# EAGLE design controller_connect_board (EAGLE 7.2.0)
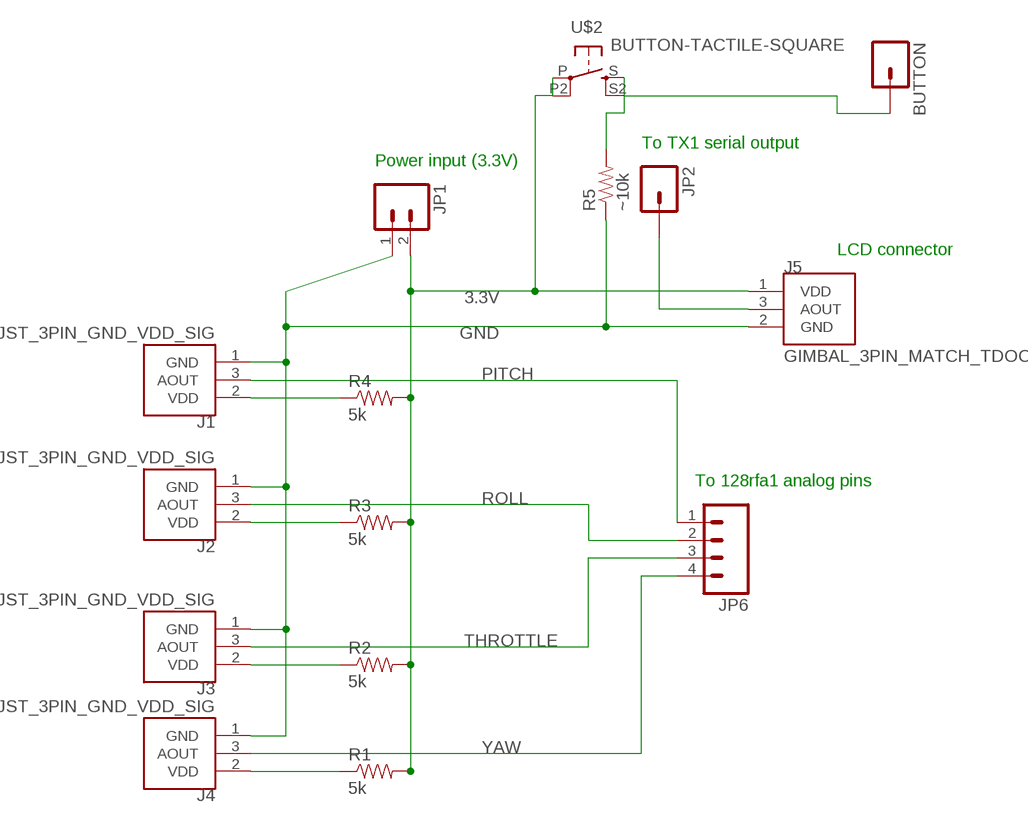
[diagram p0: schematic, sheet 1]

## Parts
BUTTON  M01PTH  [1X01]
J1  JST_3PIN_GND_VDD_SIG  [JST-3-PTH-REVERSE]
J2  JST_3PIN_GND_VDD_SIG  [JST-3-PTH-REVERSE]
J3  JST_3PIN_GND_VDD_SIG  [JST-3-PTH-REVERSE]
J4  JST_3PIN_GND_VDD_SIG  [JST-3-PTH-REVERSE]
J5  GIMBAL_3PIN_MATCH_TDOCU  [JST-3-PTH]
JP1  M021X02_NO_SILK  [1X02_NO_SILK]
JP2  M01PTH  [1X01]
JP6  M04PTH  [1X04]
R1  5k  RESISTORPTH-1/4W  [AXIAL-0.4]
R2  5k  RESISTORPTH-1/4W  [AXIAL-0.4]
R3  5k  RESISTORPTH-1/4W  [AXIAL-0.4]
R4  5k  RESISTORPTH-1/4W  [AXIAL-0.4]
R5  ~10k  RESISTORPTH-1/4W  [AXIAL-0.4]
U$2  BUTTON-TACTILE-SQUARE  [BUTTON-TACTILE-SQUARE-ADAFRUIT1010]

## Nets
3.3V: J5.1(VDD) JP1.2 R1.P$2 R2.P$2 R3.P$2 R4.P$2 U$2.P U$2.P2(P1)
GND: J1.1(GND) J2.1(GND) J3.1(GND) J4.1(GND) J5.2(GND) JP1.1 R5.P$1
N$1: J4.2(VDD) R1.P$1
N$2: J3.2(VDD) R2.P$1
N$3: J2.2(VDD) R3.P$1
N$4: J1.2(VDD) R4.P$1
N$6: BUTTON.1 R5.P$2 U$2.S U$2.S2(S1)
N$9: J5.3(AOUT) JP2.1
PITCH: J1.3(AOUT) JP6.1
ROLL: J2.3(AOUT) JP6.2
THROTTLE: J3.3(AOUT) JP6.3
YAW: J4.3(AOUT) JP6.4

## Notes on the sheet
- To TX1 serial output
- Power input (3.3V)
- LCD connector
- To 128rfa1 analog pins

## Library data of the parts
BUTTON JP2 = SparkFun-Connectors:M01: Header 1 Standard 1-pin 0.1" header. Use with straight break away headers (SKU : PRT-00116), right angle break away headers (PRT-00553), swiss pins (PRT-00743), machine pins (PRT-00117), and female headers (PRT-00115).
J1-J4 = Controller:JST_3PIN_GND_VDD_SIG
J5 = Controller:GIMBAL_3PIN_MATCH_TDOCU
JP1 = SparkFun-Connectors:M02: Standard 2-pin 0.1" header. Use with - straight break away headers ( PRT-00116) - right angle break away headers (PRT-00553) - swiss pins (PRT-00743) - machine pins (PRT-00117) - female headers (PRT-00115) Molex polarized connector foot print use with: PRT-08233 with associated crimp pins and housings. 2.54_SCREWTERM for use with PRT-10571. 3.5mm Screw Terminal footprints for PRT-08084 5mm Screw Terminal footprints for use with PRT-08432
JP6 = SparkFun-Connectors:M04: Header 4 Standard 4-pin 0.1" header. Use with straight break away headers (SKU : PRT-00116), right angle break away headers (PRT-00553), swiss pins (PRT-00743), machine pins (PRT-00117), and female headers (PRT-00115). Molex polarized connector foot print use with SKU : PRT-08231 with associated crimp pins and housings. 1MM SMD Version SKU: PRT-10208
R1-R5 = SparkFun-Resistors:RESISTOR: Resistor Basic schematic elements and footprints for 0603, 1206, and PTH resistors.
U$2 = Controller:BUTTON-TACTILE

## Board
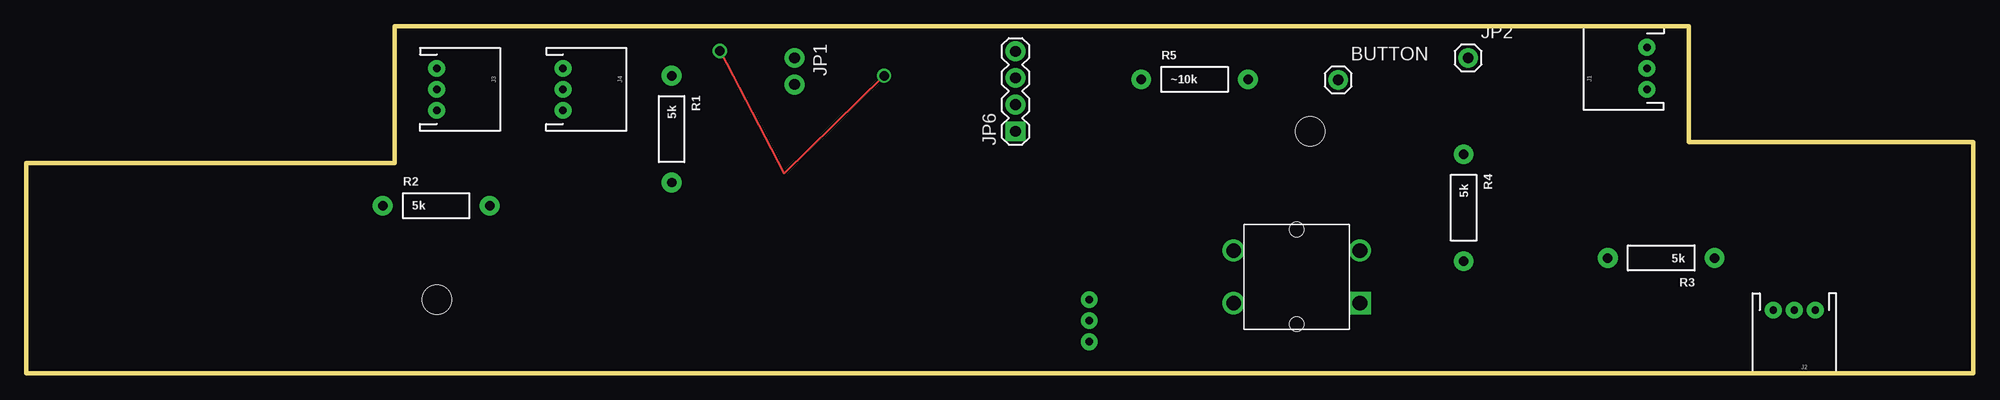
[diagram p1: board, top side]
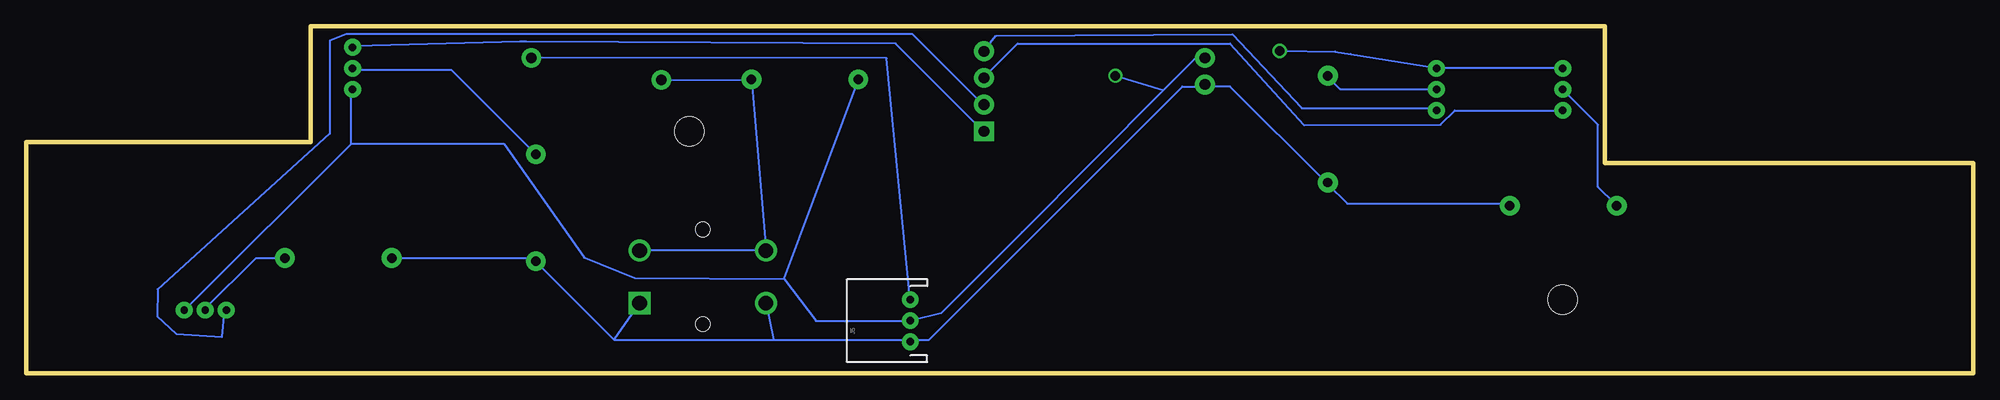
[diagram p2: board, bottom side, seen from below]

Size 185 x 33 mm. Coordinates in mm from the lower left corner, seen from the top.
Outline: 0,0 185,0 185,22 158,22 158,33 35,33 35,20 0,20 0,0
Copper layers (1*16): Top 0.035559375mm / dielectric 1.501140625mm / Bottom 0.035559375mm
Design rules "4pcb-33board *": minimum track width 0.2mm, minimum drill 0.9mm, track to track 10mil, track to pad 12mil, pad to pad 0.39mm, via to via 0.8mm, smd to smd 6mil, copper to edge 10mil, drill to drill 10mil, minimum pad ring 10mil, minimum via ring 8mil, stop-mask expansion 4mil, vias tented up to drill 0mil, thermal gap 10mil
tRestrict: area 38,23 to 40.2,30.1; area 32.6,14.9 to 35.1,17; area 42.7,14.7 to 45.6,17.4; area 49.6,23.8 to 52.3,30.3; area 71.4,26 to 74.4,31.3; area 92.3,21 to 95.8,32.5; area 99.7,1.6 to 102.3,8.6; area 135.2,9.3 to 137.9,12.1; area 135,19.4 to 138,22.1; area 135.2,28.3 to 139,31.6; area 152.7,25.7 to 155.2,32.4; area 149.1,9.7 to 151.5,12.2; 4 more areas

### Footprints (pad centres in the part's own frame; a part is rotated, then mirrored left to right if it is on the bottom)
1X01 = drill 1.016 pad 1.88: 1 0,0
JST-3-PTH-REVERSE = drill 0.7 pad 1.6: 1 -2,0; 2 0,0; 3 2,0
JST-3-PTH = drill 0.7 pad 1.6: 1 -2,0; 2 0,0; 3 2,0
1X02_NO_SILK = drill 1.016 pad 1.88: 1 0,0; 2 2.54,0
1X04 = drill 1.016 pad 1.88 square: 1 0,0 | drill 1.016 pad 1.88: 2 2.54,0; 3 5.08,0; 4 7.62,0
AXIAL-0.4 = drill 0.9 pad 1.88: P$1 -5.08,0; P$2 5.08,0
CONNECTOR_BOARD_OUTLINE = hole 2.8: 71,29; 154,45
BUTTON-TACTILE-SQUARE-ADAFRUIT1010 = drill 1.4 square: P -6,2.5 | drill 1.4: P2 6,2.5; S -6,-2.5; S2 6,-2.5 | hole 1.4: 0,4.5; 0,-4.5

### Placement (x,y rotation side)
BUTTON  124.66,27.9 0 top
J1  154,29 90 top
J2  168,6 180 top
J3  39,27 270 top
J4  51,27 270 top
J5  101,5 90 bottom
JP1  73,30 270 top
JP2  137,30 0 top
JP6  94,23 90 top
R1  61.32,23.22 270 top
R2  38.95,15.94 0 top
R3  155.35,10.96 180 top
R4  136.58,15.74 270 top
R5  111.01,27.94 0 top
U$1  [CONNECTOR_BOARD_OUTLINE]  -32,-22 0 top
U$2  120.72,9.17 180 top

### Tracks (layer width: path | path; a pad name or v marks a point on that pad's centre or on a via)
3.3V
  Bottom 0.2: R2.P$2 44.05,16.14 59.48,16.14 61.3,17.95 R1.P$2 61.52,18.18 70.6,27.26 72.87,27.26 JP1.2 73.1,27.26 75.14,27.26 99.21,3.2 100.79,3.2 J5.1 101.02,3.2 114,3.2 | 129.17,3.2 114,3.2 | 129.17,3.2 136.43,10.46 R4.P$2 136.66,10.69 136.89,10.91 150.05,10.91 R3.P$2 | U$2.P2 114,3.2 | 129.17,3.2 U$2.P
GND  (via drill 0.9)
  Top 0.2: v65.91,30.66 72,19 v81.52,28.3
  Bottom 0.2: 154.14,21.81 154.14,26.8 J1.1 | 154.14,21.81 169.8,6.15 J2.1 | J3.1 39.05,29.08 50.86,29.08 J4.1 51.08,29.08 59.15,30.36 60.65,30.6 v65.91,30.66 | 76.93,26.93 73.97,29.9 JP1.1 | 76.93,26.93 90.41,13.41 98.07,5.71 100.79,5.01 J5.2 | 154.14,21.81 139.61,21.81 132,11 127.18,9.05 112.98,8.96 | 101.02,5.01 J5.2 | 112.98,8.96 109.98,4.96 J5.2 | 112.98,8.96 R5.P$1 | v81.52,28.3 76.93,26.93
N$1
  Bottom 0.2: J4.2 51.08,27.03 60.16,27.03 61.3,28.17 R1.P$1
N$2
  Bottom 0.2: J3.2 38.82,26.8 35.65,23.63 35.65,17.73 34.06,16.14 R2.P$1
N$3
  Bottom 0.2: J2.2 167.99,6.15 163.22,10.91 160.5,10.91 R3.P$1
N$4
  Bottom 0.2: J1.2 153.91,28.85 144.61,28.85 136.66,20.9 R4.P$1
N$6
  Bottom 0.2: BUTTON.1 R5.P$2 U$2.S2 U$2.S
N$9
  Bottom 0.2: J5.3 101.02,7.06 103.25,29.97 JP2.1 136.89,29.98
PITCH
  Bottom 0.2: J1.3 153.91,31.12 138.09,31.55 137.5,31.55 102.38,31.34 94.21,23.17 JP6.1
ROLL
  Bottom 0.2: J2.3 166.17,5.92 166.39,3.45 170.74,3.74 172.54,5.39 172.53,7.97 156.17,22.77 156.16,31.63 154.59,32.25 100.79,32.25 94.21,25.67 JP6.2
THROTTLE
  Bottom 0.2: J3.3 39.05,24.99 49.27,24.99 50.63,23.63 63.59,23.59 70.6,31.34 90.81,31.34 93.98,28.17 JP6.3
YAW
  Bottom 0.2: J4.3 51.08,25.22 63.79,25.22 70.4,32.23 92.85,32.09 93.98,30.66 JP6.4